# EAGLE schematic aslglove (EAGLE 5.07)
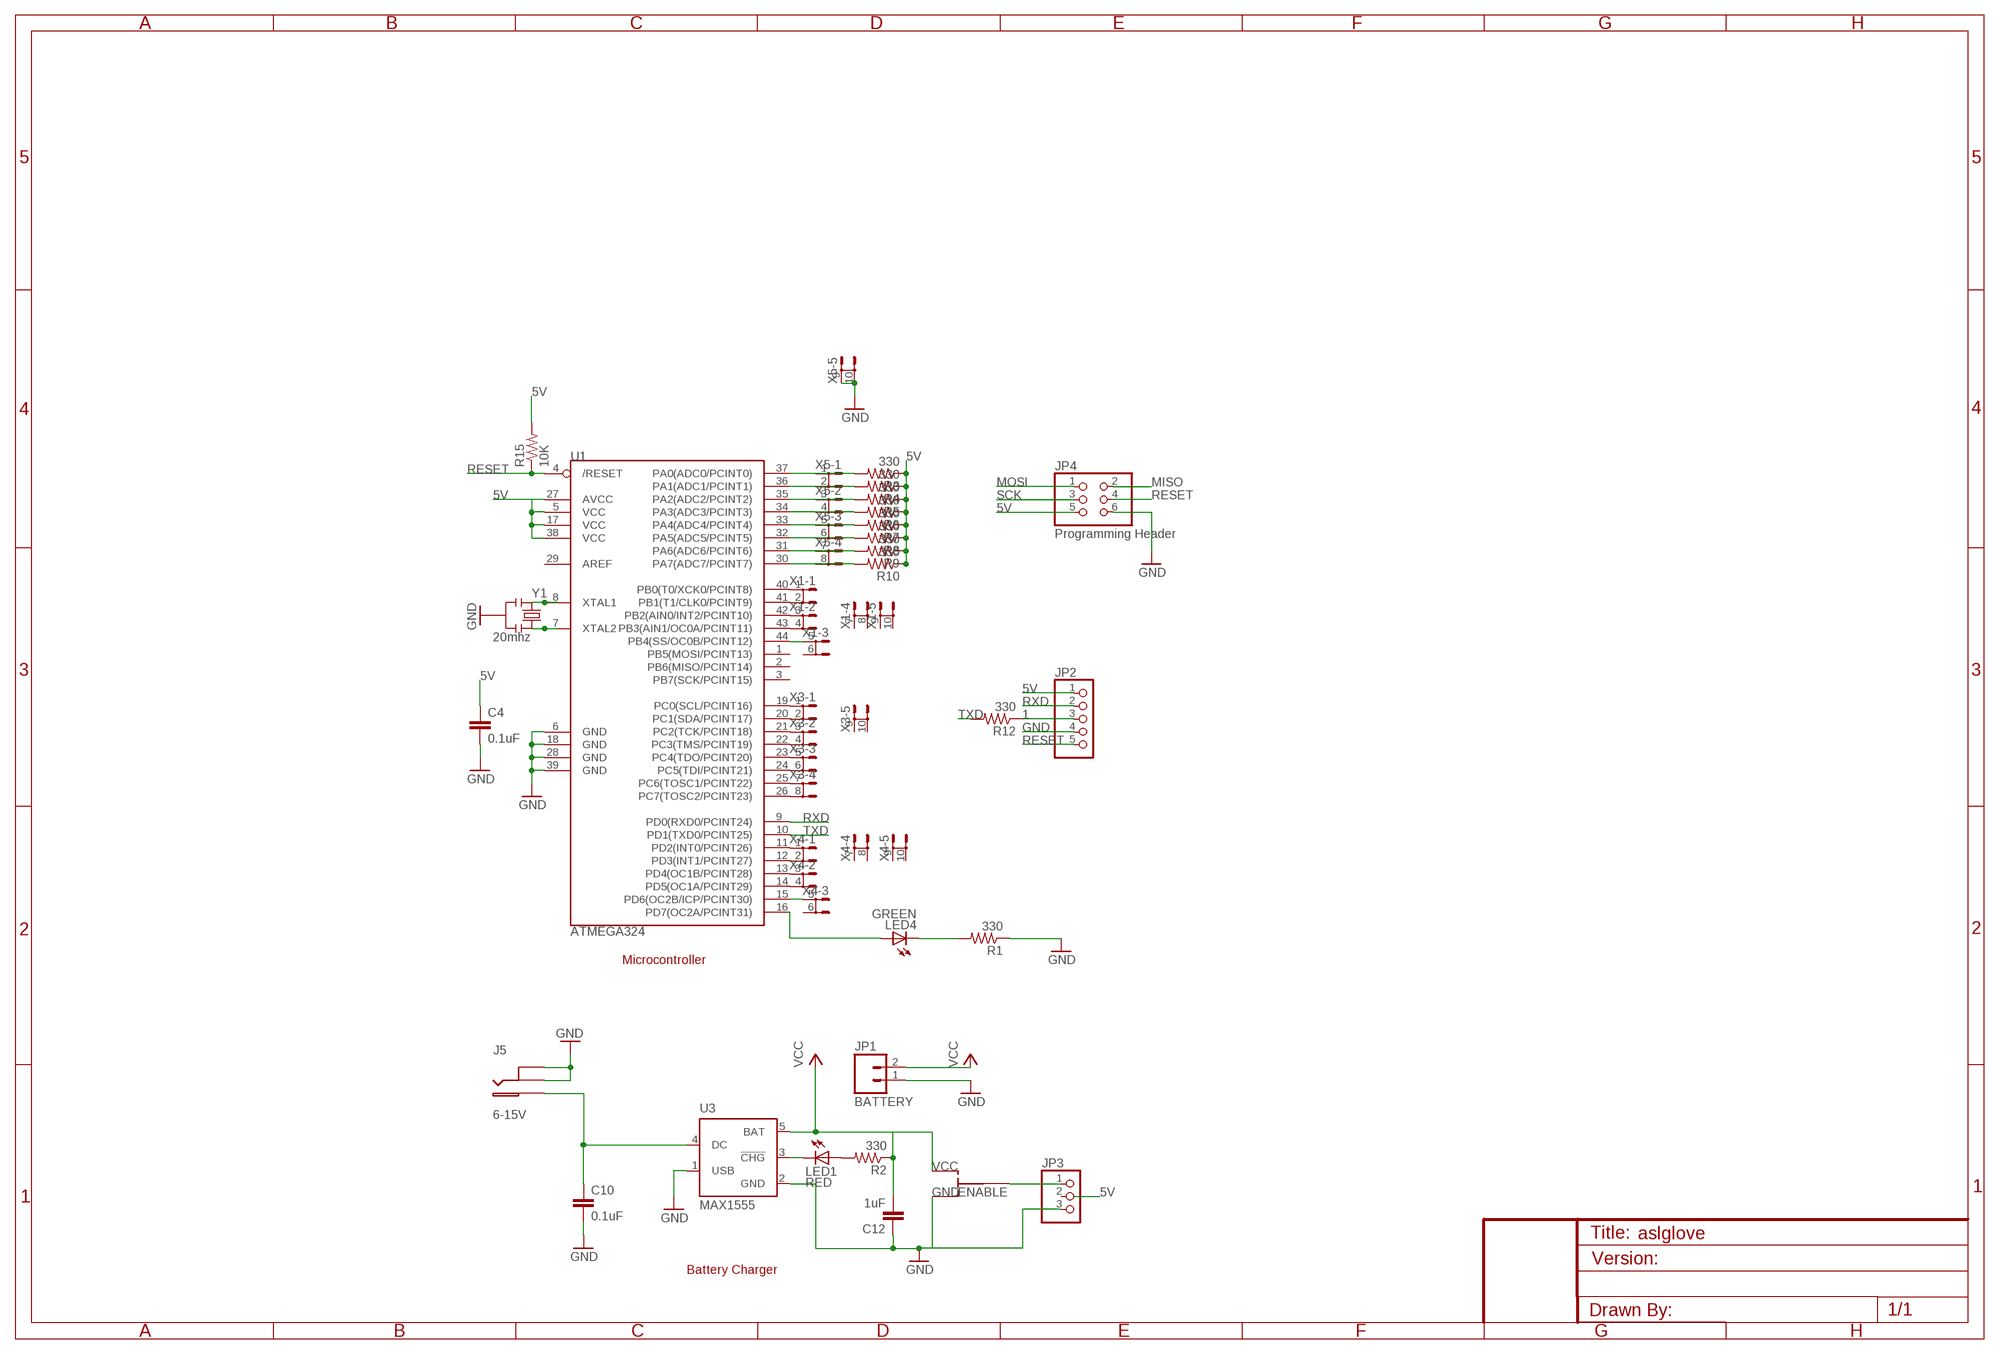
[diagram p0: schematic, sheet 1]

## Parts
C4  0.1uF  CAP0603-CAP  [0603-CAP]
C10  0.1uF  CAP0603-CAP  [0603-CAP]
C12  1uF  CAP0603-CAP  [0603-CAP]
J5  6-15V  DC-PWR-3PIN  [DC-PWR-CUI-PJ-038-SMT]
JP1  BATTERY  M02-JST-2MM-SMT  [S2B-PH]
JP2  PINHD-1X5/90  [1X05/90]
JP3  PINHD-1X3/90  [1X03/90]
JP4  Programming Header  PINHD-2X3  [2X03]
LED1  RED  LED0603  [LED-0603]
LED4  GREEN  LED0603  [LED-0603]
R1  330  RESISTOR0603-RES  [0603-RES]
R2  330  RESISTOR0603-RES  [0603-RES]
R3  330  RESISTOR0603-RES  [0603-RES]
R4  330  RESISTOR0603-RES  [0603-RES]
R5  330  RESISTOR0603-RES  [0603-RES]
R6  330  RESISTOR0603-RES  [0603-RES]
R7  330  RESISTOR0603-RES  [0603-RES]
R8  330  RESISTOR0603-RES  [0603-RES]
R9  330  RESISTOR0603-RES  [0603-RES]
R10  330  RESISTOR0603-RES  [0603-RES]
R12  330  RESISTOR0603-RES  [0603-RES]
R15  10K  RESISTOR0603-RES  [0603-RES]
S1  TOGGLE-SPDT-SMD  [ET01MD1SA1BE]
U1  ATMEGA324  [TQFP44]
U3  MAX1555  [SOT23-5L]
X1  SH5-5  [SH5-5]
X3  SH5-5  [SH5-5]
X4  SH5-5  [SH5-5]
X5  SH5-5  [SH5-5]
Y1  20mhz  RESONATORSMD  [RESONATOR-SMD]

## Nets
1: JP2.3 R12.1
5V: C4.1 JP2.1 R3.1 R4.1 R5.1 R6.1 R7.1 R8.1 R9.1 R10.1 R15.2 U1.5(VCC) U1.17(VCC) U1.27(AVCC) U1.38(VCC)
ENABLE: JP3.1 S1.2(COMMON)
GND: C4.2 C10.2 C12.1 J5.RING1 J5.RING2 JP1.1 JP2.4 JP3.3 JP4.6 R1.1 S1.1(ON1) U1.6(GND) U1.18(GND) U1.28(GND) U1.39(GND) U3.1(USB) U3.2(GND) X5.9 X5.10 Y1.2
MOSI: JP4.1
N$1: LED4.C R1.2
N$2: C10.1 J5.TIP U3.4(DC)
N$14: LED1.C U3.3(!CHG)
N$15: LED1.A R2.2
N$19: R3.2 U1.37(PA0(ADC0/PCINT0)) X5.1
N$35: U1.8(XTAL1) Y1.1
N$41: U1.19(PC0(SCL/PCINT16)) X3.1
N$43: R4.2 U1.36(PA1(ADC1/PCINT1)) X5.2
N$44: R5.2 U1.35(PA2(ADC2/PCINT2)) X5.3
N$45: U1.7(XTAL2) Y1.3
N$46: R6.2 U1.34(PA3(ADC3/PCINT3)) X5.4
N$49: R7.2 U1.33(PA4(ADC4/PCINT4)) X5.5
N$53: R8.2 U1.32(PA5(ADC5/PCINT5)) X5.6
N$54: R9.2 U1.31(PA6(ADC6/PCINT6)) X5.7
N$57: R10.2 U1.30(PA7(ADC7/PCINT7)) X5.8
N$58: U1.20(PC1(SDA/PCINT17)) X3.2
N$59: U1.21(PC2(TCK/PCINT18)) X3.3
N$61: U1.22(PC3(TMS/PCINT19)) X3.4
N$62: U1.23(PC4(TDO/PCINT20)) X3.5
N$73: U1.24(PC5(TDI/PCINT21)) X3.6
N$83: U1.25(PC6(TOSC1/PCINT22)) X3.7
N$96: U1.26(PC7(TOSC2/PCINT23)) X3.8
N$97: U1.40(PB0(T0/XCK0/PCINT8)) X1.1
N$98: U1.41(PB1(T1/CLK0/PCINT9)) X1.2
N$99: U1.42(PB2(AIN0/INT2/PCINT10)) X1.3
N$100: U1.43(PB3(AIN1/OC0A/PCINT11)) X1.4
N$101: U1.44(PB4(SS/OC0B/PCINT12)) X1.5
N$102: U1.11(PD2(INT0/PCINT26)) X4.1
N$103: U1.12(PD3(INT1/PCINT27)) X4.2
N$106: U1.13(PD4(OC1B/PCINT28)) X4.3
N$108: U1.14(PD5(OC1A/PCINT29)) X4.4
N$109: LED4.A U1.16(PD7(OC2A/PCINT31))
N$110: U1.15(PD6(OC2B/ICP/PCINT30)) X4.5
RESET: JP2.5 R15.1 U1.4(/RESET)
RXD: JP2.2 U1.9(PD0(RXD0/PCINT24))
TXD: R12.2 U1.10(PD1(TXD0/PCINT25))
VCC: C12.2 JP1.2 R2.1 S1.3(ON2) U3.5(BAT)
Unconnected: JP3.2 JP4.2 JP4.3 JP4.4 JP4.5 U1.1(PB5(MOSI/PCINT13)) U1.2(PB6(MISO/PCINT14)) U1.3(PB7(SCK/PCINT15)) U1.29(AREF) X1.6 X1.7 X1.8 X1.9 X1.10 X3.9 X3.10 X4.6 X4.7 X4.8 X4.9 X4.10

## Notes on the sheet
- Microcontroller
- Battery Charger

## Library data of the parts
C4 C10 C12 = SparkFun:CAP: Capacitor Standard 0603 ceramic capacitor, and 0.1" leaded capacitor.
J5 = IMTCParts:DC-PWR-3PIN
JP1 = SparkFun:M02: Header 2 Standard 2-pin 0.1" header. Use with straight break away headers (SKU : PRT-00116), right angle break away headers (PRT-00553), swiss pins (PRT-00743), machine pins (PRT-00117), and female headers (PRT-00115). Molex polarized connector foot print use with SKU : PRT-08233 with associated crimp pins and housings.
JP2 = pinhead:PINHD-1X5: PIN HEADER
JP3 = pinhead:PINHD-1X3: PIN HEADER
JP4 = pinhead:PINHD-2X3: PIN HEADER
LED1 LED4 = SparkFun:LED: LEDs Standard schematic elements and footprints for 5mm, 3mm, 1206, and 0603 sized LEDs. 5mm - Spark Fun Electronics SKU : COM-00529 (and others)
R1-R10 R12 R15 = SparkFun:RESISTOR: Resistor Basic schematic elements and footprints for 0603, 1206, and PTH 1/10th watt (small) resistors.
S1 = IMTCParts:TOGGLE-SPDT-SMD
U1 = IMTCParts:ATMEGA324
U3 = maxim:MAX1555: Dual-Input USB/AC Adapter 1-Cell Li+ Battery Chargers Source: http://www.maxim-ic.com .. MAX1551-MAX1555.pdf
X1 X3-X5 = con-rib:SH5-5: RIBBON CABLE CONNECTOR Flachstecker / Faston
Y1 = SparkFun:RESONATOR: Resonator Small SMD resonator. This is the itty bitty 10/20MHz resonators with built in caps. CSTCE10M0G55 and CSTCE20M0V53. Footprint has been reviewed closely but hasn't been tested yet.